# Altium schematic sheet S6_Solenoid_Valve_Interlock.SchDoc: Solenoid Valve Interlock
size Tabloid; DrawnBy: Dhrumil Parikh; SheetNumber: 6; SheetTotal: 6; PageSetup: Record=PageOptions|CenterHorizontal=True|CenterVertical=True|PrintScale=0.62|XCorrection=1.00|YCorrection=1.00|PrintKind=1|BorderSize=5000000|LeftOffset=0|BottomOffset=0|Orientation=2|PaperLength=1000|PaperWidth=1000|Scale=100|PaperSource=7|PrintQuality=600|MediaType=1|DitherType=10|PaperKind=Letter|PrintScaleMode=1; PageSize: T
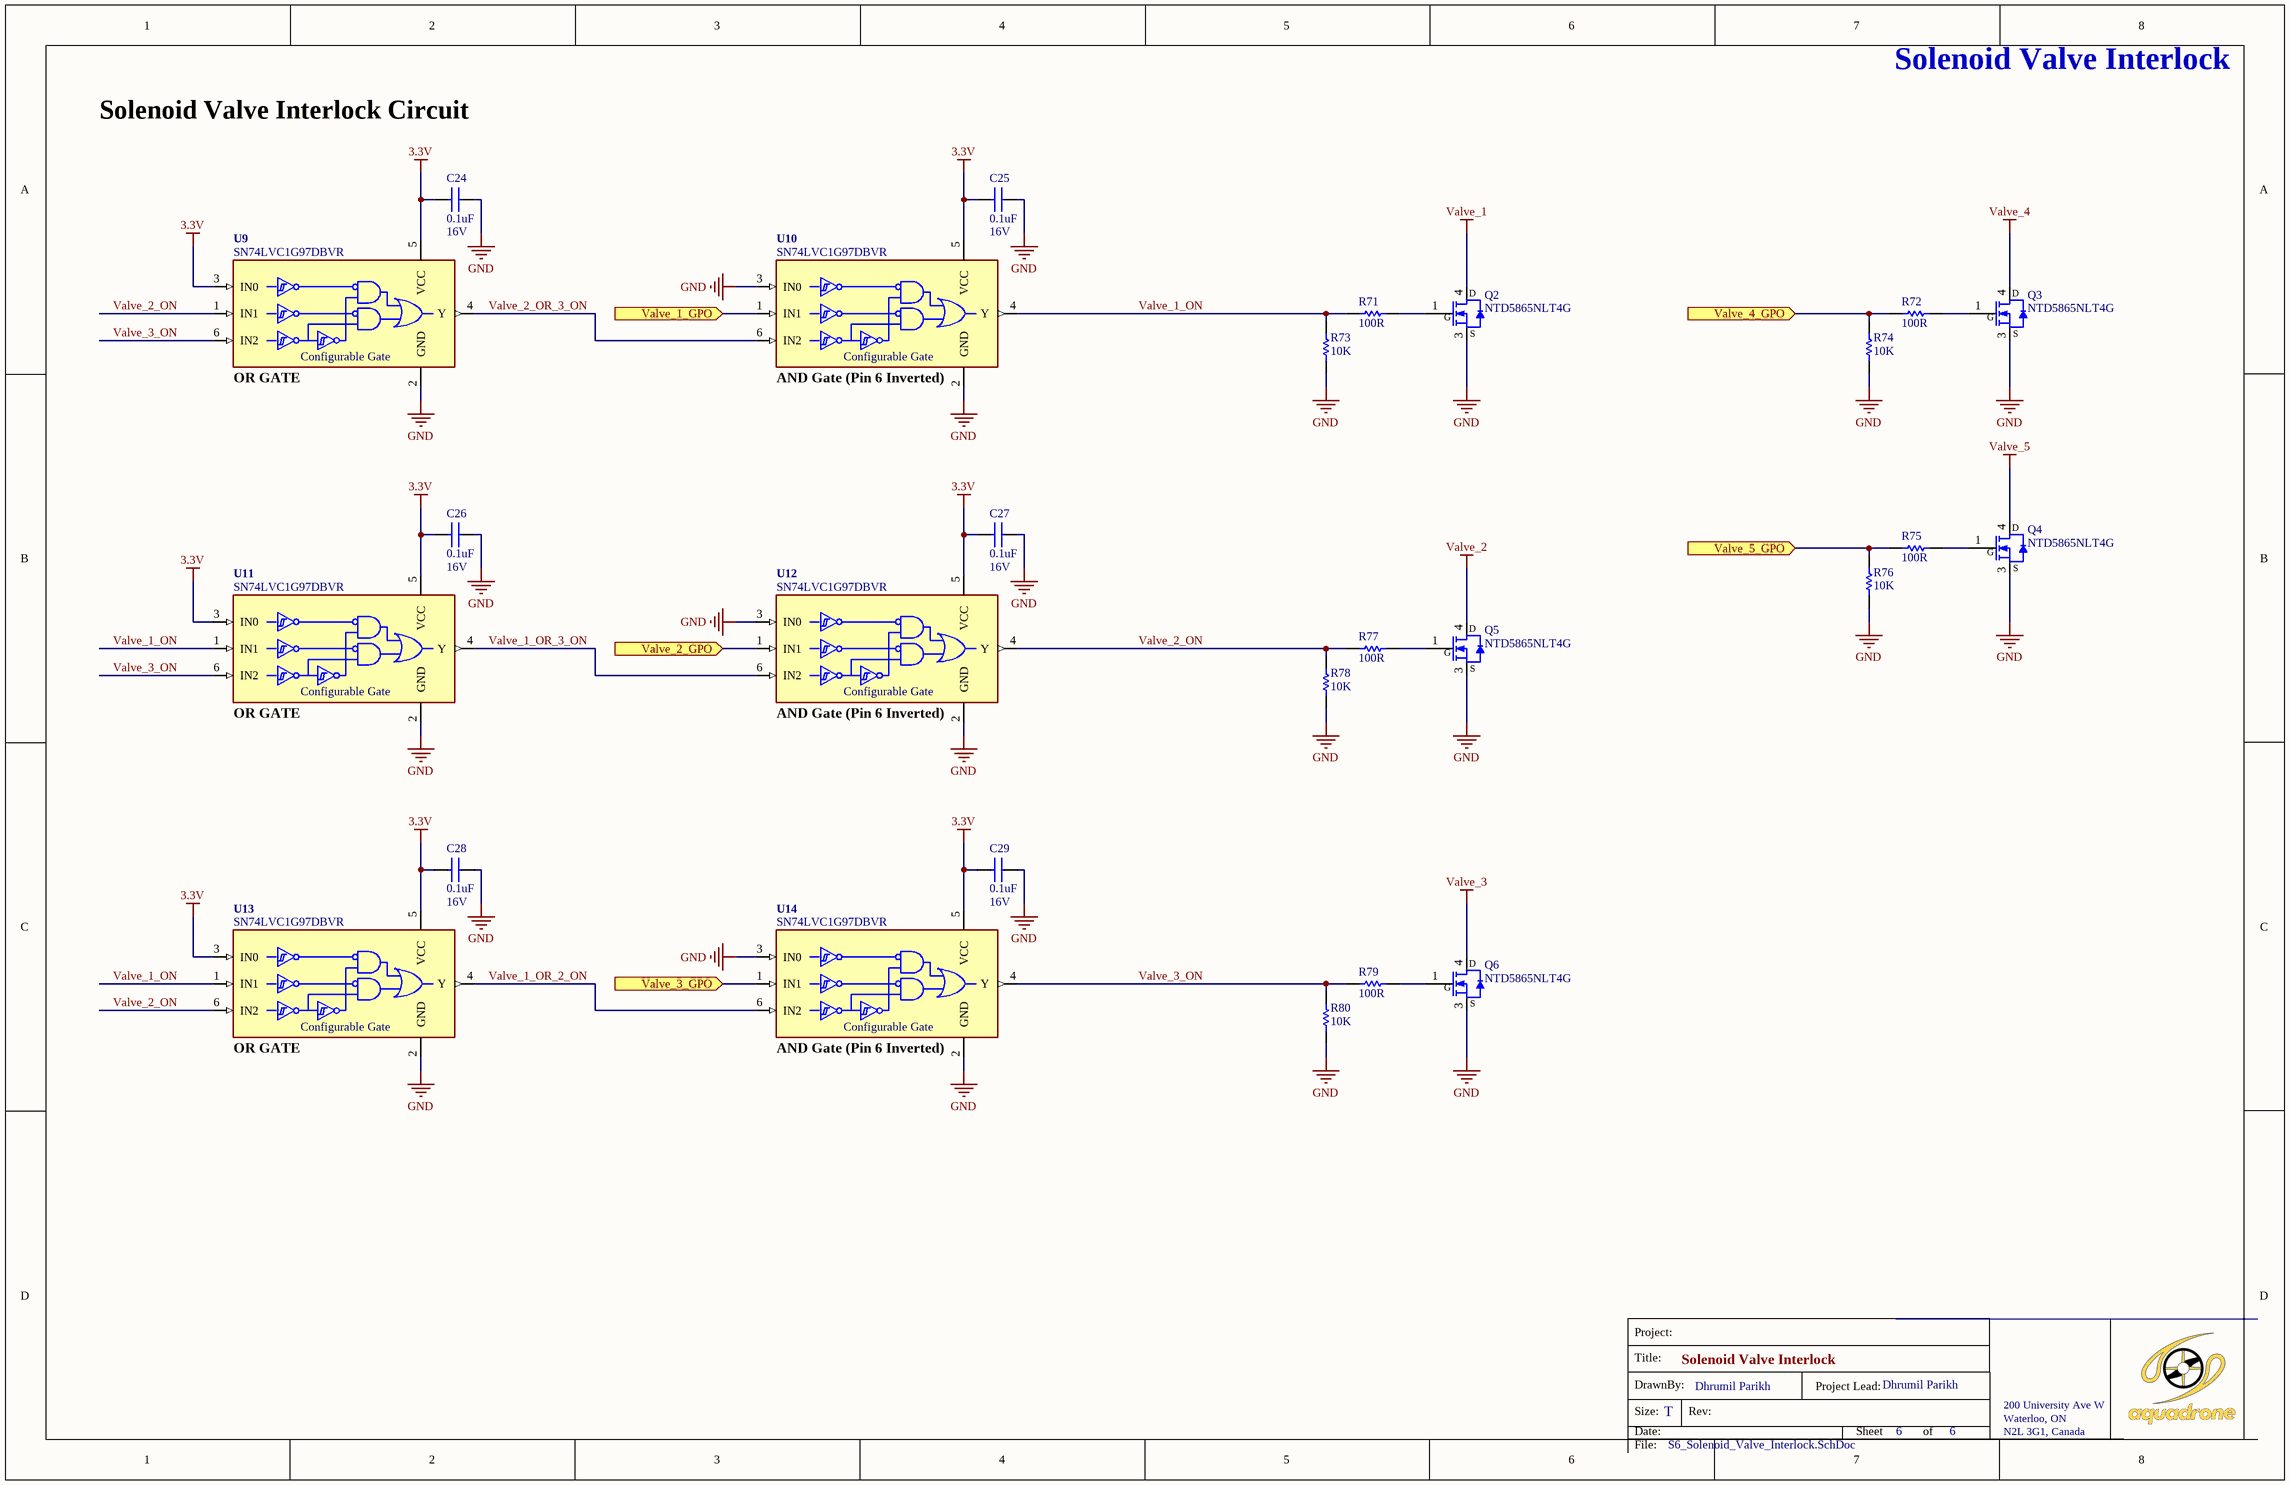
[diagram p0: S6_Solenoid_Valve_Interlock.SchDoc]

## Parts
C24  value 0.1uF  VOLTAGE: 16V  [CAPC1608X09N]  (hidden comment: CAP CER 0.1UF 16V X7R 0603)
C25  value 0.1uF  VOLTAGE: 16V  [CAPC1608X09N]  (hidden comment: CAP CER 0.1UF 16V X7R 0603)
C26  value 0.1uF  VOLTAGE: 16V  [CAPC1608X09N]  (hidden comment: CAP CER 0.1UF 16V X7R 0603)
C27  value 0.1uF  VOLTAGE: 16V  [CAPC1608X09N]  (hidden comment: CAP CER 0.1UF 16V X7R 0603)
C28  value 0.1uF  VOLTAGE: 16V  [CAPC1608X09N]  (hidden comment: CAP CER 0.1UF 16V X7R 0603)
C29  value 0.1uF  VOLTAGE: 16V  [CAPC1608X09N]  (hidden comment: CAP CER 0.1UF 16V X7R 0603)
Q2  MFG_PART_NO: NTD5865NLT4G  [TO229P990X238-4N]  (hidden comment: MOSFET N-CH 60V 46A DPAK)
Q3  MFG_PART_NO: NTD5865NLT4G  [TO229P990X238-4N]  (hidden comment: MOSFET N-CH 60V 46A DPAK)
Q4  MFG_PART_NO: NTD5865NLT4G  [TO229P990X238-4N]  (hidden comment: MOSFET N-CH 60V 46A DPAK)
Q5  MFG_PART_NO: NTD5865NLT4G  [TO229P990X238-4N]  (hidden comment: MOSFET N-CH 60V 46A DPAK)
Q6  MFG_PART_NO: NTD5865NLT4G  [TO229P990X238-4N]  (hidden comment: MOSFET N-CH 60V 46A DPAK)
R71  value 100R  [RESC1608X06N]  (hidden comment: RES SMD 100 OHM 1% 1/10W 0603)
R72  value 100R  [RESC1608X06N]  (hidden comment: RES SMD 100 OHM 1% 1/10W 0603)
R73  value 10K  [RESC1608X06N]  (hidden comment: RES SMD 10K OHM 1% 1/10W 0603)
R74  value 10K  [RESC1608X06N]  (hidden comment: RES SMD 10K OHM 1% 1/10W 0603)
R75  value 100R  [RESC1608X06N]  (hidden comment: RES SMD 100 OHM 1% 1/10W 0603)
R76  value 10K  [RESC1608X06N]  (hidden comment: RES SMD 10K OHM 1% 1/10W 0603)
R77  value 100R  [RESC1608X06N]  (hidden comment: RES SMD 100 OHM 1% 1/10W 0603)
R78  value 10K  [RESC1608X06N]  (hidden comment: RES SMD 10K OHM 1% 1/10W 0603)
R79  value 100R  [RESC1608X06N]  (hidden comment: RES SMD 100 OHM 1% 1/10W 0603)
R80  value 10K  [RESC1608X06N]  (hidden comment: RES SMD 10K OHM 1% 1/10W 0603)
U9  value SN74LVC1G97DBVR  [SOT65P210X110-6N_SN74LVC1G97DCK]  (hidden comment: IC CONFIG MULT-FUNC GATE SOT23-6)
U10  value SN74LVC1G97DBVR  [SOT65P210X110-6N_SN74LVC1G97DCK]  (hidden comment: IC CONFIG MULT-FUNC GATE SOT23-6)
U11  value SN74LVC1G97DBVR  [SOT65P210X110-6N_SN74LVC1G97DCK]  (hidden comment: IC CONFIG MULT-FUNC GATE SOT23-6)
U12  value SN74LVC1G97DBVR  [SOT65P210X110-6N_SN74LVC1G97DCK]  (hidden comment: IC CONFIG MULT-FUNC GATE SOT23-6)
U13  value SN74LVC1G97DBVR  [SOT65P210X110-6N_SN74LVC1G97DCK]  (hidden comment: IC CONFIG MULT-FUNC GATE SOT23-6)
U14  value SN74LVC1G97DBVR  [SOT65P210X110-6N_SN74LVC1G97DCK]  (hidden comment: IC CONFIG MULT-FUNC GATE SOT23-6)

## Ports
Valve_1_GPO (in), Valve_2_GPO (in), Valve_3_GPO (in), Valve_4_GPO (in), Valve_5_GPO (in)

## Nets
3.3V: C24.2 C25.2 C26.2 C27.2 C28.2 C29.2 U9.3(IN0) U9.5(VCC) U10.5(VCC) U11.3(IN0) U11.5(VCC) U12.5(VCC) U13.3(IN0) U13.5(VCC) U14.5(VCC)
GND: C24.1 C25.1 C26.1 C27.1 C28.1 C29.1 Q2.3(S) Q3.3(S) Q4.3(S) Q5.3(S) Q6.3(S) R73.1 R74.1 R76.1 R78.1 R80.1 U9.2(GND) U10.2(GND) U10.3(IN0) U11.2(GND) U12.2(GND) U12.3(IN0) U13.2(GND) U14.2(GND) U14.3(IN0)
Valve_1: Q2.4(D)
Valve_2: Q5.4(D)
Valve_3: Q6.4(D)
Valve_4: Q3.4(D)
Valve_5: Q4.4(D)
Valve_1_GPO: U10.1(IN1) ; port Valve_1_GPO
Valve_1_ON: R71.1 R73.2 U10.4(Y) U11.1(IN1) U13.1(IN1)
Valve_1_OR_2_ON: U13.4(Y) U14.6(IN2)
Valve_1_OR_3_ON: U11.4(Y) U12.6(IN2)
Valve_2_GPO: U12.1(IN1) ; port Valve_2_GPO
Valve_2_ON: R77.1 R78.2 U9.1(IN1) U12.4(Y) U13.6(IN2)
Valve_2_OR_3_ON: U9.4(Y) U10.6(IN2)
Valve_3_GPO: U14.1(IN1) ; port Valve_3_GPO
Valve_3_ON: R79.1 R80.2 U9.6(IN2) U11.6(IN2) U14.4(Y)
Valve_4_GPO: R72.1 R74.2 ; port Valve_4_GPO
Valve_5_GPO: R75.1 R76.2 ; port Valve_5_GPO
NetQ2_1: Q2.1(G) R71.2
NetQ3_1: Q3.1(G) R72.2
NetQ4_1: Q4.1(G) R75.2
NetQ5_1: Q5.1(G) R77.2
NetQ6_1: Q6.1(G) R79.2

## Notes on the sheet
- Solenoid Valve Interlock Circuit
- (near U9) OR GATE
- (near U10) AND Gate (Pin 6 Inverted)
- (near U11) OR GATE
- (near U12) AND Gate (Pin 6 Inverted)
- (near U13) OR GATE
- (near U14) AND Gate (Pin 6 Inverted)
- Title:
- Project:
- Size:
- Date:
- DrawnBy:
- Rev:
- Project Lead:
- Sheet
- Dhrumil Parikh
- of
- 200 University Ave W
- Waterloo, ON
- N2L 3G1, Canada
- File:
- (in symbol IC CONFIG MULT-FUNC GATE SOT23-6) Configurable Gate

## Library data of the parts
C24-C29 = CAP CER 0.1UF 16V X7R 0603: MFG_PART_NO: C0603C104M4RACTU; MFG: KEMET; TOLERANCE: 20%; COST: 0.14; DIELECTRIC: X7R
Q2-Q6 = MOSFET N-CH 60V 46A DPAK: MFG: ON Semiconductor; VALUE: 16mOhm @ 20A, 10V; COST: 0.97
R71 R72 R75 R77 R79 = RES SMD 100 OHM 1% 1/10W 0603: MFG_PART_NO: RC0603FR-07100RL; MFG: Yageo; COST: 0.15; TOLERANCE: 1%
R73 R74 R76 R78 R80 = RES SMD 10K OHM 1% 1/10W 0603: MFG_PART_NO: CRCW060310K0FKEA; MFG: Vishay Dale; COST: 0.15; TOLERANCE: 1%
U9-U14 = IC CONFIG MULT-FUNC GATE SOT23-6: MFG: TI; COST: 0.58; MFG_PART_NO: SN74LVC1G97DBVR